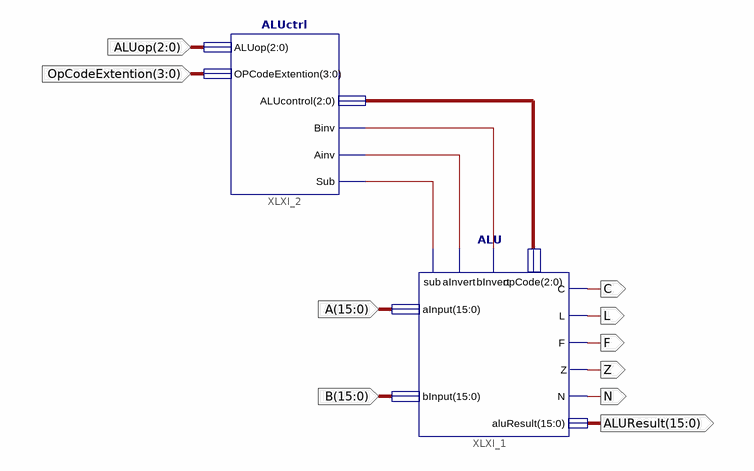
[diagram p0: schematic sheet 1]
// Xilinx ISE schematic ALU_ALUCont_test_schematic.sch (spartan3e) as structural Verilog: 2 symbols, 10 ports
module ALU_ALUCont_test_schematic (
  input  [2:0] ALUop,
  input  [3:0] OpCodeExtention,
  input  [15:0] A,
  input  [15:0] B,
  output [15:0] ALUResult,
  output N,
  output Z,
  output F,
  output L,
  output C
);

  wire XLXN_1, XLXN_2, XLXN_3;
  wire [2:0] XLXN_4;

  ALU XLXI_1 (
    .sub(XLXN_1), .aInvert(XLXN_2), .bInvert(XLXN_3), .aInput(A), .bInput(B), .opCode(XLXN_4), .C(C), .L(L),
    .F(F), .Z(Z), .N(N), .aluResult(ALUResult));
  ALUctrl XLXI_2 (
    .ALUop(ALUop), .OPCodeExtention(OpCodeExtention), .Ainv(XLXN_2), .Binv(XLXN_3), .Sub(XLXN_1),
    .ALUcontrol(XLXN_4));
endmodule
